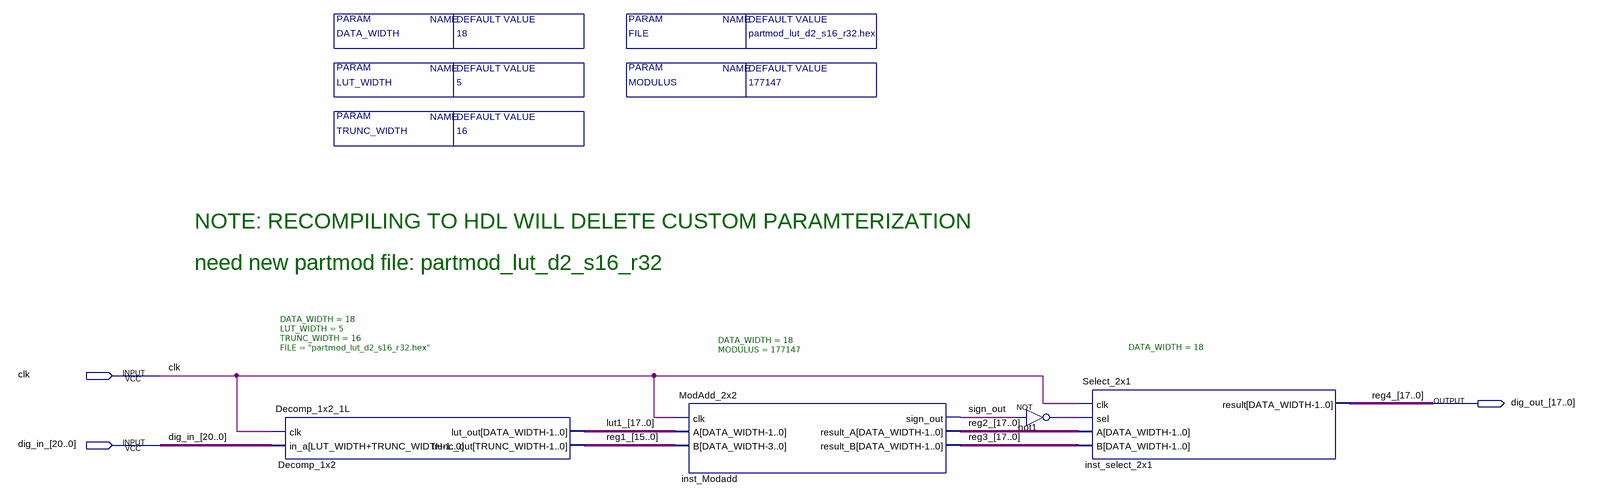
[diagram p0: schematic sheet]
// Quartus schematic digmod18_21.bdf as structural Verilog: 4 symbols, 3 pins
module digmod18_21 #(parameter DATA_WIDTH = 18, parameter LUT_WIDTH = 5, parameter TRUNC_WIDTH = 16, parameter FILE = "partmod_lut_d2_s16_r32.hex", parameter MODULUS = 177147) (
  input  clk,
  input  [20:0] dig_in_,
  output [17:0] dig_out_
);

  wire not1_out, sign_out;
  wire [15:0] reg1_;
  wire [17:0] lut1_, reg2_, reg3_;

  Decomp_1x2_1L #(.DATA_WIDTH(18), .LUT_WIDTH(5), .TRUNC_WIDTH(16), .FILE("partmod_lut_d2_s16_r32.hex")) Decomp_1x2 (
    .clk(clk), .in_a(dig_in_), .lut_out(lut1_), .trunc_out(reg1_));
  ModAdd_2x2 #(.DATA_WIDTH(18), .MODULUS(177147)) inst_Modadd (
    .clk(clk), .A(lut1_), .B(reg1_), .sign_out(sign_out), .result_A(reg2_), .result_B(reg3_));
  not not1 (not1_out, sign_out);
  Select_2x1 #(.DATA_WIDTH(18)) inst_select_2x1 (.clk(clk), .sel(not1_out), .A(reg2_), .B(reg3_), .result(dig_out_));

  // Other names for the same wires on the sheet: reg4_[17:0] = dig_out_

  // Notes on the sheet:
  //   NOTE: RECOMPILING TO HDL WILL DELETE CUSTOM PARAMTERIZATION
  //   need new partmod file: partmod_lut_d2_s16_r32
endmodule
